# Altium schematic sheet DXP格式 单片机万年历LCD1602显示.SchDoc
size A4
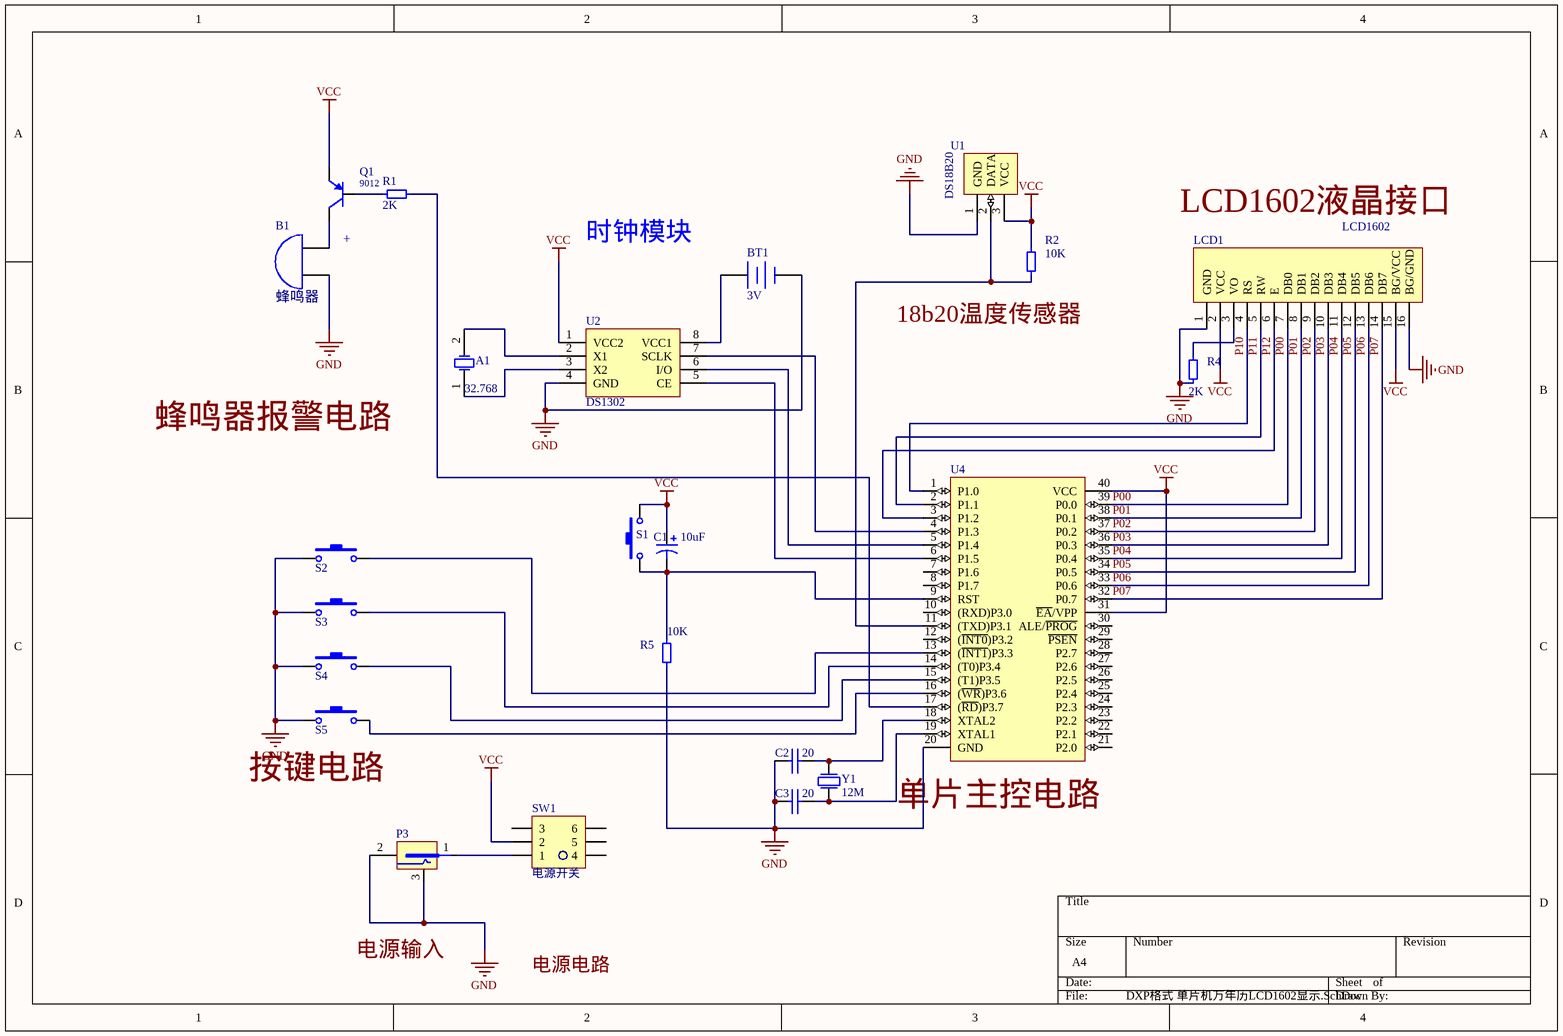
[diagram p0: DXP格式 单片机万年历LCD1602显示.SchDoc]

## Parts
A1  32.768  [HDR1X2]
B1  蜂鸣器  [Bett]
BT1  3V  [BATT]
C1  10uF  [C_10]
C2  20  [CAP5]
C3  20  [CAP5]
LCD1  LCD1602  [1602]
P3  电源输入  [DC2.1]  (value not drawn)
Q1  9012  [s三极管直插]
R1  2K  [AXIAL0.3]
R2  10K  [AXIAL0.3]
R4  2K  [AXIAL0.3]
R5  10K  [res400mil]
S1  SW-PB  [key]  (value not drawn)
S2  SW-PB  [key]  (value not drawn)
S3  SW-PB  [key]  (value not drawn)
S4  SW-PB  [key]  (value not drawn)
S5  SW-PB  [key]  (value not drawn)
SW1  电源开关  [sw_自锁 1]
U1  DS18B20  [18B20]
U2  DS1302  [DIP8]
U4  STC89C52  [DIP40 - 做板]  (value not drawn)
Y1  12M  [XTAL]

## Nets
GND: B1.2(B) BT1.2(-) C2.1 C3.1 LCD1.1(GND) LCD1.16(BG/GND) P3.2 P3.3 R4.2 R5.1 S2.1 S3.1 S4.1 S5.1 U1.1(GND) U2.4(GND) U4.20(GND)
VCC: C1.1 LCD1.2(VCC) LCD1.15(BG/VCC) Q1.1(E) R2.2 S1.2 SW1.2 U1.3(VCC) U2.1(VCC2) U4.31(~{EA}/VPP) U4.40(VCC)
P00: LCD1.7(DB0) U4.39(P0.0)
P01: LCD1.8(DB1) U4.38(P0.1)
P02: LCD1.9(DB2) U4.37(P0.2)
P03: LCD1.10(DB3) U4.36(P0.3)
P04: LCD1.11(DB4) U4.35(P0.4)
P05: LCD1.12(DB5) U4.34(P0.5)
P06: LCD1.13(DB6) U4.33(P0.6)
P07: LCD1.14(DB7) U4.32(P0.7)
P10: LCD1.4(RS) U4.1(P1.0)
P11: LCD1.5(RW) U4.2(P1.1)
P12: LCD1.6(E) U4.3(P1.2)
NetA1_1: A1.1(OSC1) U2.3(X2)
NetA1_2: A1.2(OSC2) U2.2(X1)
NetB1_1: B1.1(A) Q1.3(C)
NetBT1_1: BT1.1(+) U2.8(VCC1)
NetC1_2: C1.2 R5.2 S1.1 U4.9(RST)
NetC2_2: C2.2 U4.18(XTAL2) Y1.1(P1)
NetC3_2: C3.2 U4.19(XTAL1) Y1.2(P2)
NetLCD1_3: LCD1.3(VO) R4.1
NetP3_1: P3.1 SW1.1
NetQ1_2: Q1.2(B) R1.1
NetR1_2: R1.2 U4.17((~{RD})P3.7)
NetR2_1: R2.1 U1.2(DATA) U4.11((TXD)P3.1)
NetS2_2: S2.2 U4.13((~{INT1})P3.3)
NetS3_2: S3.2 U4.14((T0)P3.4)
NetS4_2: S4.2 U4.15((T1)P3.5)
NetS5_2: S5.2 U4.16((~{WR})P3.6)
NetU2_5: U2.5(CE) U4.6(P1.5)
NetU2_6: U2.6(I/O) U4.5(P1.4)
NetU2_7: U2.7(SCLK) U4.4(P1.3)

Not connected (* = marked no-connect by the designer): SW1 3 4 5 6; U4 7(P1.6) 8(P1.7) 10((RXD)P3.0) 12((~{INT0})P3.2) 21(P2.0) 22(P2.1) 23(P2.2) 24(P2.3) 25(P2.4) 26(P2.5) 27(P2.6) 28(P2.7) 29(~{PSEN}) 30(ALE/~{PROG})

## Notes on the sheet
- +
- 时钟模块
- Labels drawn without touching a wire or pin: 18b20温度传感器, LCD1602液晶接口, 单片主控电路, 按键电路, 电源电路, 电源输入, 蜂鸣器报警电路

## Library data of the parts
A1 = XTA
B1 = BELL
BT1 = Battery: Multicell Battery; Published: 24-Mar-1999; LatestRevisionDate: 17-Jul-2002; LatestRevisionNote: Re-released for DXP Platform.; PackageReference: BAT-2; Publisher: Altium Limited
C1 = Cap Pol1: Polarized Capacitor (Radial); Published: 8-Jun-2000; LatestRevisionDate: 17-Jul-2002; LatestRevisionNote: Re-released for DXP Platform.; PackageReference: RB7.6-15; Publisher: Altium Limited
C2 C3 = CAP: 电容
P3 = POWER
Q1 = 2N3906: PNP General Purpose Amplifier; Published: 8-Jun-2000; LatestRevisionDate: 15-Jan-2003; LatestRevisionNote: PCB Footprint 'BCY-W3/D4.7' replaced; DatasheetDocument: 1997; PackageDocument: Sep-1998; PackageReference: TO-92A; Publisher: Altium Limited; Code_JEDEC: TO-92A; ComponentLink1Description: Manufacturer Link; ComponentLink1URL: http://www.fairchildsemi.com/; ComponentLink2Description: Datasheet; ComponentLink2URL: http://www.fairchildsemi.com/ds/2N%2F2N3906.pdf
R1 R2 R4 R5 = RES2
S1-S5 = SW-PB: Switch; Published: 24-Mar-1999; LatestRevisionDate: 17-Jul-2002; LatestRevisionNote: Re-released for DXP Platform.; PackageReference: SPST-2; Publisher: Altium Limited
SW1 = SW1
U4 = U1
Y1 = 16M: Crystal Oscillator